# EAGLE schematic usercontroller1 (EAGLE 8.5.2)
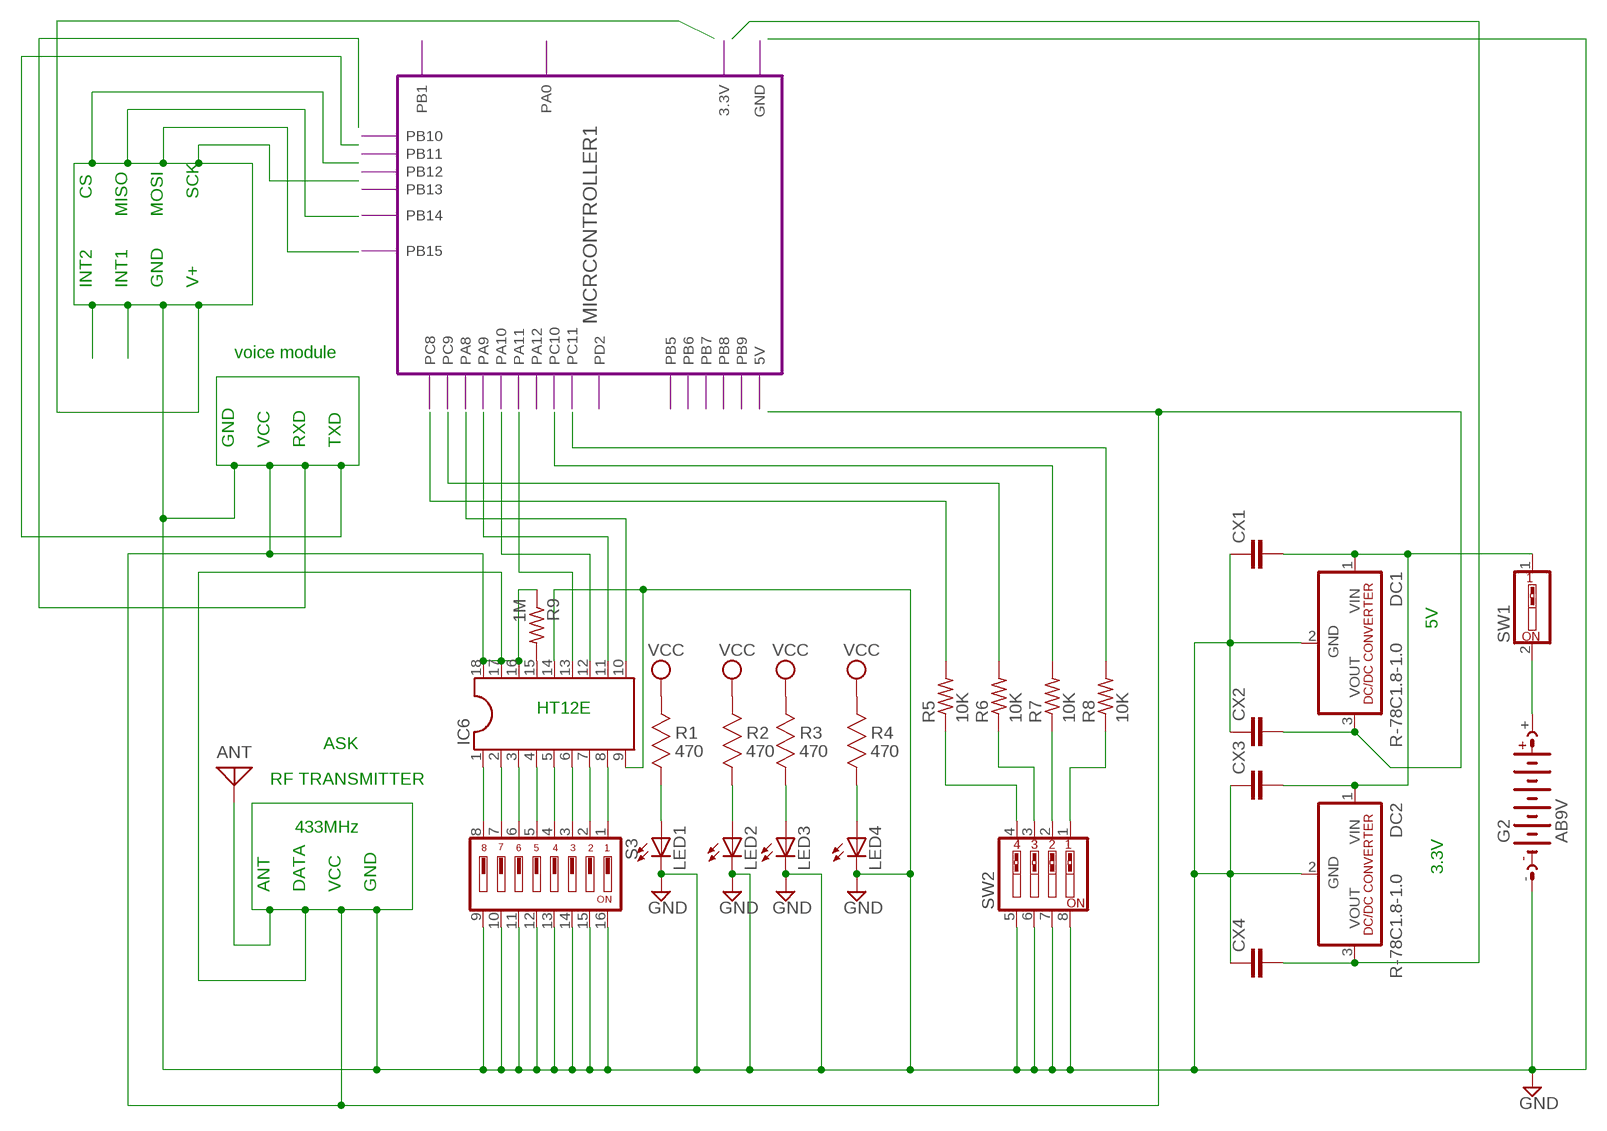
[diagram p0: schematic, sheet 1]

## Parts
ANT  ANTENNA  [PAD-01]
CX1  CXXC10B5  [XC10B5]
CX2  CXXC10B5  [XC10B5]
CX3  CXXC10B5  [XC10B5]
CX4  CXXC10B5  [XC10B5]
DC1  R-78C1.8-1.0  [SIP3]
DC2  R-78C1.8-1.0  [SIP3]
G2  AB9V  [AB9V]
IC6  DIL18  [DIL18]
LED1  LEDCHIP-LED0603  [CHIP-LED0603]
LED2  LEDCHIP-LED0603  [CHIP-LED0603]
LED3  LEDCHIP-LED0603  [CHIP-LED0603]
LED4  LEDCHIP-LED0603  [CHIP-LED0603]
R1  470  MC0.063W06031%330R  [RESC1608X60N]
R2  470  MC0.063W06031%330R  [RESC1608X60N]
R3  470  MC0.063W06031%330R  [RESC1608X60N]
R4  470  MC0.063W06031%330R  [RESC1608X60N]
R5  10K  R-US_0204/2V  [0204V]
R6  10K  R-US_0204/2V  [0204V]
R7  10K  R-US_0204/2V  [0204V]
R8  10K  R-US_0204/2V  [0204V]
R9  1M  R-US_0207/12  [0207/12]
S3  DA08  [DA-08]
SW1  SW_DIP-1  [EDG-01]
SW2  SW_DIP-4  [EDG-04]

## Module instances
MICRCONTROLLER1 = MICRCONTROLLER

## Nets
GND: ANT.1 CX1.1 CX2.1 CX2.2 CX3.1 CX4.1 DC1.2(GND) DC1.3(VOUT) DC2.2(GND) G2.- IC6.9 IC6.14 IC6.16 IC6.17 IC6.18 LED1.C LED2.C LED3.C LED4.C R9.1 S3.9 S3.10 S3.11 S3.12 S3.13 S3.14 S3.15 S3.16 SW2.5 SW2.6 SW2.7 SW2.8
N$1: LED2.A R2.2(R2)
N$2: LED3.A R3.2(R2)
N$3: LED4.A R4.2(R2)
N$4: LED1.A R1.2(R2)
N$5: CX1.2 CX3.2 DC1.1(VIN) DC2.1(VIN) SW1.1
N$6: IC6.15 R9.2
N$7: IC6.8 S3.1
N$8: IC6.7 S3.2
N$9: R8.1 SW2.1
N$10: CX4.2 DC2.3(VOUT)
N$11: G2.+ SW1.2
N$12: R7.1 SW2.2
N$13: R6.1 SW2.3
N$14: R5.1 SW2.4
N$15: R5.2
N$16: R6.2
N$17: R7.2
N$18: IC6.6 S3.3
N$19: R8.2
N$20: IC6.5 S3.4
N$21: IC6.10
N$22: IC6.11
N$23: IC6.12
N$24: IC6.13
N$25: IC6.4 S3.5
N$26: IC6.3 S3.6
N$27: IC6.2 S3.7
N$28: IC6.1 S3.8
VCC: R1.1(R1) R2.1(R1) R3.1(R1)
Unconnected: R4.1(R1)

## Notes on the sheet
- CS | SCK
- MISO | MOSI
- INT2 | INT1 | GND | V+
- voice module
- GND | VCC | RXD | TXD
- 5V
- HT12E
- ASK
- RF TRANSMITTER
- 433MHz
- 3.3V
- ANT | DATA | VCC | GND

## Library data of the parts
ANT = discrete:ANTENNA: Antenna
CX1-CX4 = rcl:CX: X CAPACITOR for power line; SPICEPREFIX: C
DC1 DC2 = dc-dc-converter:R-78C*-1.0: INNOLINE DC/DC-Converter 1.0 AMP SIP3 Single Output Source: Data sheet <http://www.mikrocontroller.net/attachment/150645/157764-da-01-en-DC_DC_WANDLER_R_78C5_0_1_0.pdf>
G2 = battery:AB9V: 9-V BATTERY CLIP
IC6 = ic-package:DIL18: Dual In Line / Socket
LED1-LED4 = led:LED: LED OSRAM: - CHIPLED LG R971, LG N971, LY N971, LG Q971, LY Q971, LO R971, LY R971 LH N974, LH R974 LS Q976, LO Q976, LY Q976 LO Q996 - Hyper CHIPLED LW Q18S LB Q993, LB Q99A, LB R99A - SideLED LS A670, LO A670, LY A670, LG A670, LP A670 LB A673, LV A673, LT A673, LW A673 LH A674 LY A675 LS A676, LA A676, LO A676, LY A676, LW A676 LS A679, LY A679, LG A679 - Hyper Micro SIDELED® LS Y876, LA Y876, LO Y876, LY Y876 LT Y87S - SmartLED LW L88C, LW L88S LB L89C, LB L89S, LG L890 LS L89K, LO L89K, LY L89K LS L896, LA L896, LO L896, LY L896 - TOPLED LS T670, LO T670, LY T670, LG T670, LP T670 LSG T670, LSP T670, LSY T670, LOP T670, LYG T670 LG T671, LOG T671, LSG T671 LB T673, LV T673, LT T673, LW T673 LH T674 LS T676, LA T676, LO T676, LY T676, LB T676, LH T676, LSB T676, LW T676 LB T67C, LV T67C, LT T67C, LS T67K, LO T67K, LY T67K, LW E67C LS E67B, LA E67B, LO E67B, LY E67B, LB E67C, LV E67C, LT E67C LW T67C LS T679, LY T679, LG T679 LS T770, LO T770, LY T770, LG T770, LP T770 LB T773, LV T773, LT T773, LW T773 LH T774 LS E675, LA E675, LY E675, LS T675 LS T776, LA T776, LO T776, LY T776, LB T776 LHGB T686 LT T68C, LB T68C - Hyper Mini TOPLED® LB M676 - Mini TOPLED Santana® LG M470 LS M47K, LO M47K, LY M47K Source: http://www.osram.convergy.de LUXEON: - LUMILED® LXK2-PW12-R00, LXK2-PW12-S00, LXK2-PW14-U00, LXK2-PW14-V00 LXK2-PM12-R00, LXK2-PM12-S00, LXK2-PM14-U00 LXK2-PE12-Q00, LXK2-PE12-R00, LXK2-PE12-S00, LXK2-PE14-T00, LXK2-PE14-U00 LXK2-PB12-K00, LXK2-PB12-L00, LXK2-PB12-M00, LXK2-PB14-N00, LXK2-PB14-P00, LXK2-PB14-Q00 LXK2-PR12-L00, LXK2-PR12-M00, LXK2-PR14-Q00, LXK2-PR14-R00 LXK2-PD12-Q00, LXK2-PD12-R00, LXK2-PD12-S00 LXK2-PH12-R00, LXK2-PH12-S00 LXK2-PL12-P00, LXK2-PL12-Q00, LXK2-PL12-R00 Source: www.luxeon.com KINGBRIGHT: KA-3528ASYC Source: www.kingbright.com
R1-R4 = Multicomp:MC0.063W06031%330R: RESISTOR, 0603; MPN: MC0.063W06031%330R; OC_FARNELL: 9331018; OC_NEWARK: -; SUPPLIER: Multicomp; TOLERANCE: ±1%; VALUE: 330 Ohms; WATTAGE: 1/16 W
R5-R8 = rcl:R-US_: RESISTOR, American symbol; SPICEPREFIX: R
R9 = resistor:R-US_: RESISTOR, American symbol
S3 = switch-dil:DA08: DIL/CODE SWITCH; MPN: MCDA08; OC_FARNELL: 9471561; OC_NEWARK: 26M1092
SW1 = special:SW_DIP-1: DIP SWITCH
SW2 = special:SW_DIP-4: DIP SWITCH

## Module MICRCONTROLLER
Ports: PB9(io) PB8(io) PB7(io) PB6(io) PB5(io) PB1(io) PA0(io) PD2(io) 3.3V(io) GND(io) 5V(io) PB10(io) PB11(io) PB12(io) PB13(io) PB14(io) PB15(io) PC8(io) PC9(io) PA8(io) PA9(io) PA10(io) PA11(io) PA12(io) PC10(io) PC11(io)

### Library data of the parts